# EAGLE design OptoIsolatorFTDI (EAGLE 9.2.2)
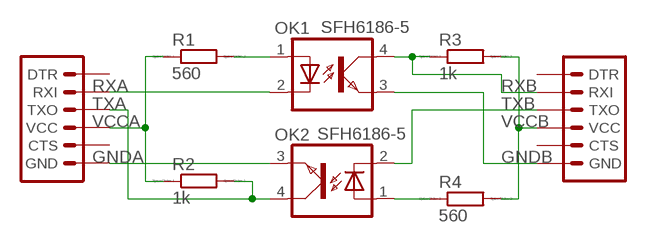
[diagram p0: schematic, sheet 1]

## Parts
JP1  FTDI  6_PIN_SERIAL_TARGET  [1X06]
JP2  FTDI_BASICPTH  6_PIN_SERIAL_TARGET  [1X06]
OK1  SFH6186-5  [SMD4-7]
OK2  SFH6186-5  [SMD4-7]
R1  560  RR0603  [R0603]
R2  1k  RR0603  [R0603]
R3  1k  RR0603  [R0603]
R4  560  RR0603  [R0603]

## Nets
GNDA: JP2.6(GND) OK2.3(EMIT)
GNDB: JP1.6(GND) OK1.3(EMIT)
N$1: OK1.1(A) R1.2
N$7: OK2.1(A) R4.1
RXA: JP2.2(RXI) OK1.2(C)
RXB: JP1.2(RXI) OK1.4(COL) R3.1
TXA: JP2.3(TXO) OK2.4(COL) R2.2
TXB: JP1.3(TXO) OK2.2(C)
VCCA: JP2.4(VCC) R1.1 R2.1
VCCB: JP1.4(VCC) R3.2 R4.2
Unconnected: JP1.1(DTR) JP1.5(CTS) JP2.1(DTR) JP2.5(CTS)

## Library data of the parts
JP1 JP2 = SparkFun-Connectors:6_PIN_SERIAL_TARGET: 6-pin header connection for use with the "FTDI BASIC" pinout - TARGET SIDE. Also known as "Arduino Serial Program Header". It is used to mate with our FTDI Basic serial programmers using the Arduino IDE. Note, this device has "TARGET" in the name. It is intended to be used on a design that contains a target micro-controller that you wish to program. The "sister" device, named "CABLE" is inteneded to be used on a design that usually lives on the end of your USB cable and prvides the converter chip (FTDI232 or FTDI231x) to commnicate serial RX/TX. You can populate with some of these: Break Away Headers - Straight <https://www.sparkfun.com/products/116> (PRT-00116) For reference (or to suit your programming needs) check out these designs: SparkFun FTDI Basic Breakout - 5V <https://www.sparkfun.com/products/9716> (DEV-09716) SparkFun FTDI Basic Breakout - 3.3V <https://www.sparkfun.com/products/9873> (DEV-09873) SparkFun FTDI SmartBasic <https://www.sparkfun.com/products/12935> (DEV-12935) SparkFun Beefy 3 - FTDI Basic Breakout <https://www.sparkfun.com/products/13746> (DEV-13746)
OK1 OK2 = optocoupler:SFH618?*: Optocoupler, Phototransistor Output, Low Input Current Source: Data sheet <http://www.vishay.com/docs/83673/sfh618.pdf>; MF: VISHAY/TELEFUNKEN; MPN: SFH6186-5; OC_FARNELL: 1469584; OC_NEWARK: 58K2211
R1-R4 = eagle-ltspice:R: RESISTOR, European symbol; SPICEMODEL: NONE; SPICEPREFIX: R

## Board
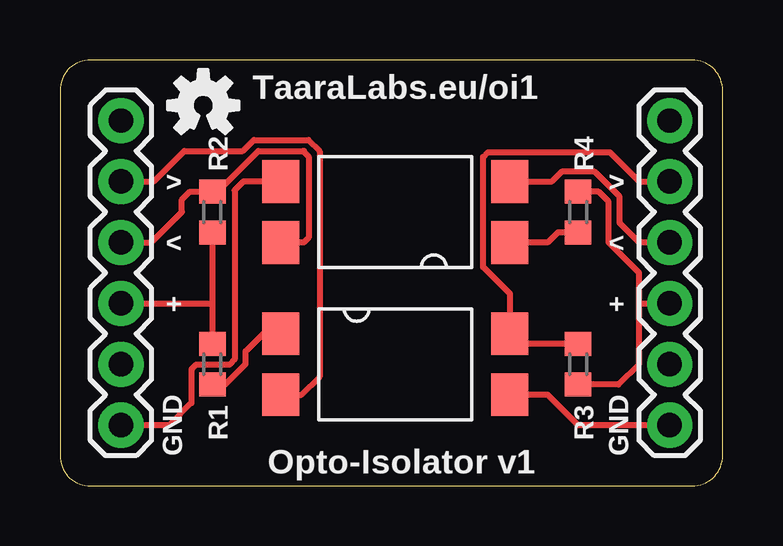
[diagram p1: board, top side]
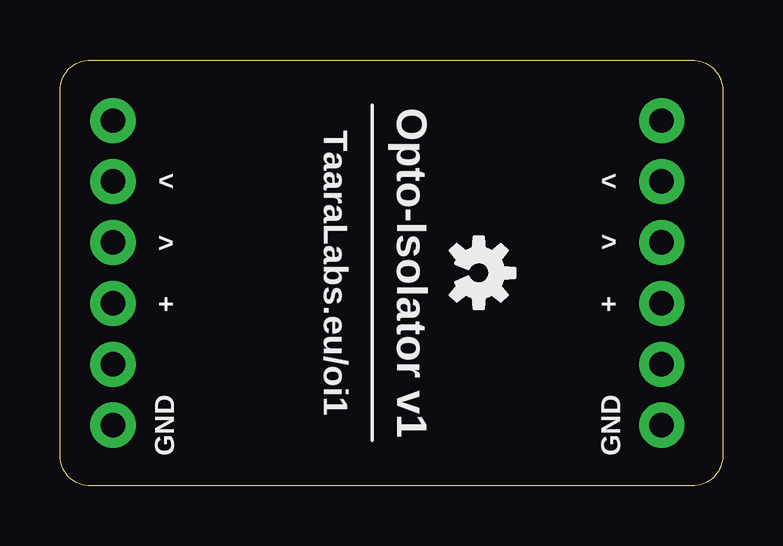
[diagram p2: board, bottom side, seen from below]

Size 27.61 x 17.77 mm. Coordinates in mm from the lower left corner, seen from the top.
Outline: 0,16.5 0,1.27 arc90 1.27,0 26.34,0 arc90 27.61,1.27 27.61,16.5 arc90 26.34,17.77 1.27,17.77 arc90 0,16.5
Copper layers (1*16): Top 0.035mm / dielectric 1.5mm / Bottom 0.035mm
Design rules "default *": minimum track width 6mil, minimum drill 0.35mm, track to track 8mil, track to pad 8mil, pad to pad 8mil, via to via 8mil, smd to smd 8mil, copper to edge 40mil, drill to drill 6mil, minimum pad ring 10mil, minimum via ring 8mil, stop-mask expansion 4mil, vias tented up to drill 0mil, thermal gap 10mil

### Footprints (pad centres in the part's own frame; a part is rotated, then mirrored left to right if it is on the bottom)
1X06 = drill 1.016 pad 1.88: 1 0,0; 2 2.54,0; 3 5.08,0; 4 7.62,0; 5 10.16,0; 6 12.7,0
SMD4-7 = smd 1.78 x 1.55: 1 -1.27,-4.77; 2 1.27,-4.77; 3 1.27,4.77; 4 -1.27,4.77
R0603 = smd 1 x 1.1: 1 -0.85,0; 2 0.85,0

### Placement (x,y rotation side)
JP1  25.4,15.24 270 top
JP2  2.54,15.24 270 top
OK1  13.97,5.08 270 top
OK2  13.97,11.43 90 top
R1  6.35,5.08 270 top
R2  6.35,11.43 90 top
R3  21.59,5.08 270 top
R4  21.59,11.43 90 top
U$1  [OSHW-LOGO-S]  5.97,15.88 0 top
U$3  [OSHW-LOGO-S]  10.16,8.89 270 bottom

### Tracks (layer width: path | path; a pad name or v marks a point on that pad's centre or on a via)
GNDA
  Top 0.254: JP2.6 4.55,2.54 5.47,3.46 5.47,4.87 5.66,5.06 7.07,5.06 7.28,5.27 7.28,12.34 7.64,12.7 OK2.3
GNDB
  Top 0.254: OK1.3 20.32,3.81 21.59,2.54 JP1.6
N$1
  Top 0.254: OK1.1 8.47,6.35 7.74,5.62 7.74,5.08 6.88,4.23 R1.2
N$7
  Top 0.254: OK2.1 20.32,10.16 20.74,10.58 R4.1
RXA
  Top 0.254: JP2.2 3.91,12.7 5.18,13.97 7.62,13.97 8.08,14.43 10.35,14.43 10.81,13.96 10.81,4.56 10.06,3.81 OK1.2
RXB
  Top 0.254: R3.1 19.16,5.93 OK1.4 18.74,8.03 17.64,9.13 17.64,13.73 17.83,13.92 22.91,13.92 24.13,12.7 JP1.2
TXA
  Top 0.254: OK2.4 10.16,10.16 10.36,10.36 10.36,13.75 10.16,13.94 10.16,13.97 10.13,13.97 8.27,13.97 6.58,12.28 R2.2 5.41,12.28 5.08,11.95 5.08,11.43 3.81,10.16 JP2.3
TXB
  Top 0.254: JP1.3 24.13,10.16 23.32,10.97 23.32,12.07 22.28,13.11 20.9,13.11 20.49,12.7 OK2.2
VCCA
  Top 0.254: R2.1 6.35,7.62 | 6.35,7.62 R1.1 | JP2.4 6.35,7.62
VCCB
  Top 0.254: R3.2 23.28,4.23 24.13,5.08 24.13,7.62 | 24.13,7.62 JP1.4 | 24.13,7.62 24.13,8.89 22.86,10.16 22.86,11.86 22.44,12.28 R4.2

### Text on the board
tNames: TaaraLabs.eu/oi1 | > | > | > | > | > | < | < | < | + | + | + | GND | GND | GND | GND | Opto-Isolator v1
bNames: > | > | < | > | Opto-Isolator v1 | TaaraLabs.eu/oi1 | + | + | GND | GND